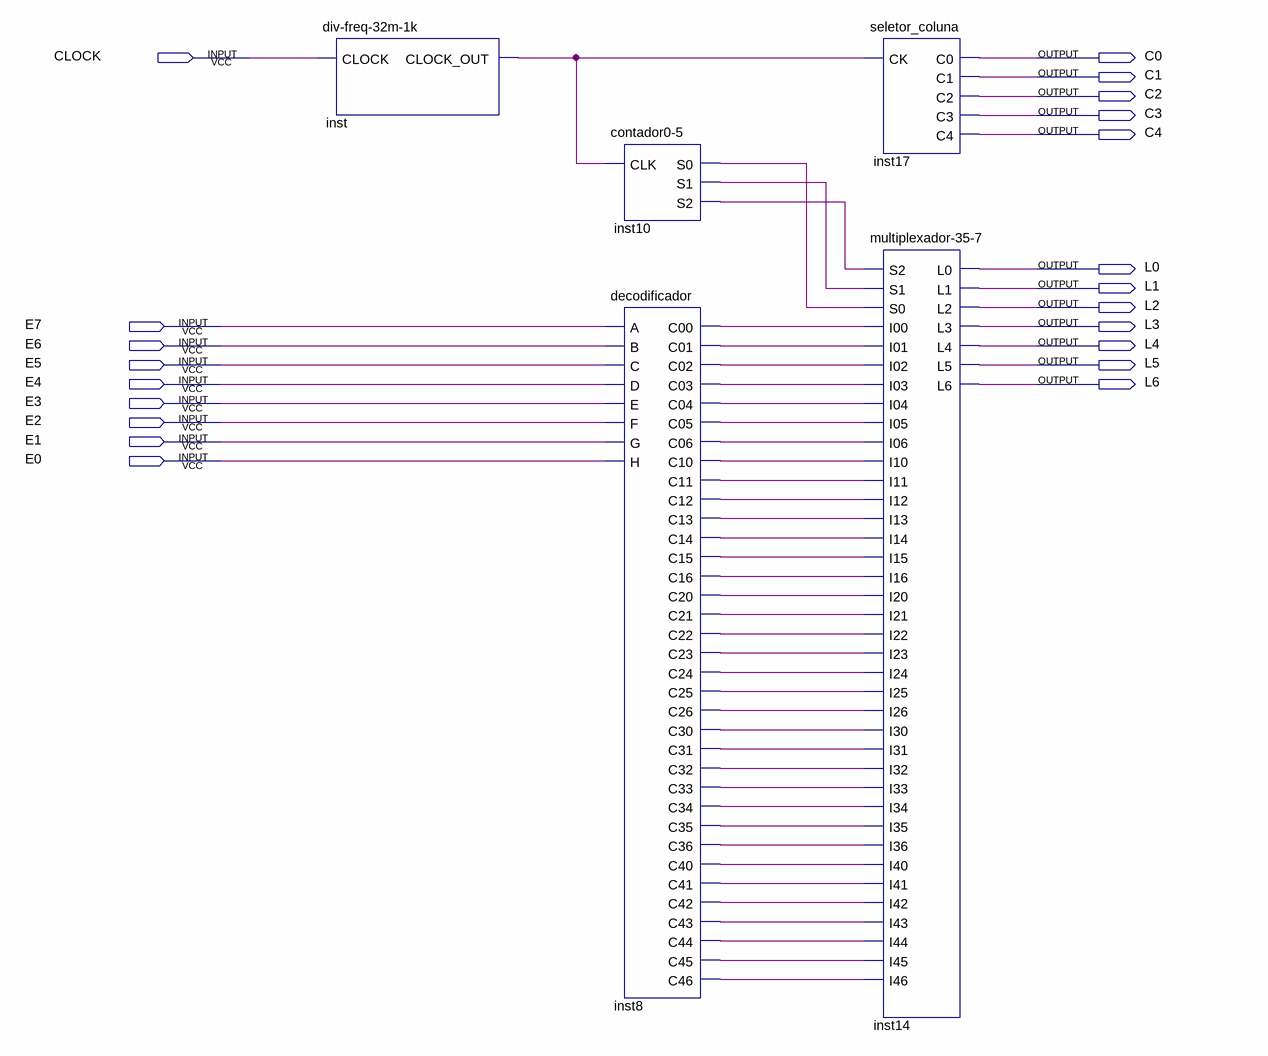
[diagram p0: schematic sheet]
// Quartus schematic exibir.bdf as structural Verilog: 5 symbols, 21 pins
module exibir (
  input  CLOCK,
  input  E7,
  input  E6,
  input  E5,
  input  E4,
  input  E3,
  input  E2,
  input  E1,
  input  E0,
  output C0,
  output C1,
  output C2,
  output C3,
  output C4,
  output L0,
  output L1,
  output L2,
  output L3,
  output L4,
  output L5,
  output L6
);

  wire inst8_c00, inst8_c01, inst8_c02, inst8_c03, inst8_c04, inst8_c05, inst8_c06, inst8_c10, inst8_c11,
       inst8_c12, inst8_c13, inst8_c14, inst8_c15, inst8_c16, inst8_c20, inst8_c21, inst8_c22, inst8_c23,
       inst8_c24, inst8_c25, inst8_c26, inst8_c30, inst8_c31, inst8_c32, inst8_c33, inst8_c34, inst8_c35,
       inst8_c36, inst8_c40, inst8_c41, inst8_c42, inst8_c43, inst8_c44, inst8_c45, inst8_c46, inst10_s0,
       inst10_s1, inst10_s2, inst_clock_out;

  \div-freq-32m-1k  inst (.CLOCK(CLOCK), .CLOCK_OUT(inst_clock_out));
  \contador0-5  inst10 (.CLK(inst_clock_out), .S0(inst10_s0), .S1(inst10_s1), .S2(inst10_s2));
  decodificador inst8 (
    .A(E7), .B(E6), .C(E5), .D(E4), .E(E3), .F(E2), .G(E1), .H(E0), .C00(inst8_c00), .C01(inst8_c01),
    .C02(inst8_c02), .C03(inst8_c03), .C04(inst8_c04), .C05(inst8_c05), .C06(inst8_c06), .C10(inst8_c10),
    .C11(inst8_c11), .C12(inst8_c12), .C13(inst8_c13), .C14(inst8_c14), .C15(inst8_c15), .C16(inst8_c16),
    .C20(inst8_c20), .C21(inst8_c21), .C22(inst8_c22), .C23(inst8_c23), .C24(inst8_c24), .C25(inst8_c25),
    .C26(inst8_c26), .C30(inst8_c30), .C31(inst8_c31), .C32(inst8_c32), .C33(inst8_c33), .C34(inst8_c34),
    .C35(inst8_c35), .C36(inst8_c36), .C40(inst8_c40), .C41(inst8_c41), .C42(inst8_c42), .C43(inst8_c43),
    .C44(inst8_c44), .C45(inst8_c45), .C46(inst8_c46));
  seletor_coluna inst17 (.CK(inst_clock_out), .C0(C0), .C1(C1), .C2(C2), .C3(C3), .C4(C4));
  \multiplexador-35-7  inst14 (
    .S2(inst10_s2), .S1(inst10_s1), .S0(inst10_s0), .I00(inst8_c00), .I01(inst8_c01), .I02(inst8_c02),
    .I03(inst8_c03), .I04(inst8_c04), .I05(inst8_c05), .I06(inst8_c06), .I10(inst8_c10), .I11(inst8_c11),
    .I12(inst8_c12), .I13(inst8_c13), .I14(inst8_c14), .I15(inst8_c15), .I16(inst8_c16), .I20(inst8_c20),
    .I21(inst8_c21), .I22(inst8_c22), .I23(inst8_c23), .I24(inst8_c24), .I25(inst8_c25), .I26(inst8_c26),
    .I30(inst8_c30), .I31(inst8_c31), .I32(inst8_c32), .I33(inst8_c33), .I34(inst8_c34), .I35(inst8_c35),
    .I36(inst8_c36), .I40(inst8_c40), .I41(inst8_c41), .I42(inst8_c42), .I43(inst8_c43), .I44(inst8_c44),
    .I45(inst8_c45), .I46(inst8_c46), .L0(L0), .L1(L1), .L2(L2), .L3(L3), .L4(L4), .L5(L5), .L6(L6));
endmodule
